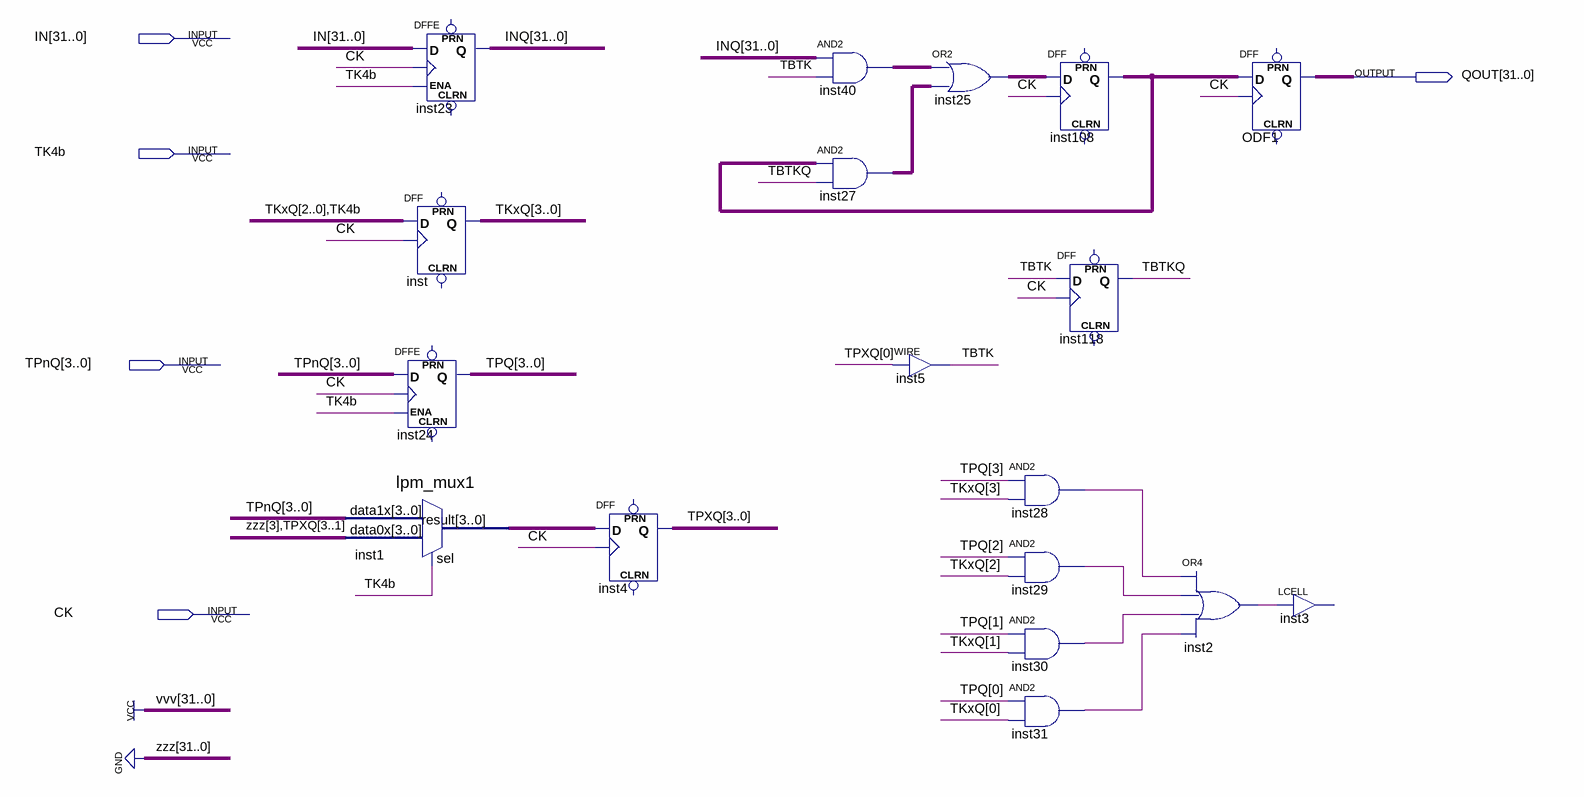
[diagram p0: schematic sheet]
// Quartus schematic Out32ch.bdf as structural Verilog: 18 symbols, 5 pins
module Out32ch (
  input  [31:0] IN,
  input  TK4b,
  input  [3:0] TPnQ,
  input  CK,
  output [31:0] QOUT
);

  wire inst2_out, inst28_out, inst29_out, inst30_out, inst31_out, TBTK, TBTKQ;
  wire [3:0] inst1_result, TKxQ, TPQ, TPXQ;
  wire [31:0] INQ, inst25_out, inst27_out, inst40_out, inst108_q;

  DFFE inst24[3:0] (.D(TPnQ), .CLK(CK), .ENA(TK4b), .Q(TPQ));  // open: PRN, CLRN
  lpm_mux1 inst1 (.data1x(TPnQ), .data0x({1'b0, TPXQ[3:1]}), .sel(TK4b), .result(inst1_result));
  DFFE inst23[31:0] (.D(IN), .CLK(CK), .ENA(TK4b), .Q(INQ));  // open: PRN, CLRN
  DFF inst[3:0] (.CLK(CK), .D({TKxQ[2:0], TK4b}), .Q(TKxQ));  // open: CLRN, PRN
  DFF inst4[3:0] (.CLK(CK), .D(inst1_result), .Q(TPXQ));  // open: CLRN, PRN
  assign inst40_out = INQ & {32{TBTK}};  // AND2 inst40, 32 bits wide
  assign inst27_out = inst108_q & {32{TBTKQ}};  // AND2 inst27, 32 bits wide
  assign inst25_out = inst40_out | inst27_out;  // OR2 inst25, 32 bits wide
  assign TBTK = TPXQ[0];  // WIRE inst5
  and inst28 (inst28_out, TPQ[3], TKxQ[3]);
  and inst29 (inst29_out, TPQ[2], TKxQ[2]);
  and inst30 (inst30_out, TPQ[1], TKxQ[1]);
  and inst31 (inst31_out, TPQ[0], TKxQ[0]);
  DFF inst108[31:0] (.CLK(CK), .D(inst25_out), .Q(inst108_q));  // open: CLRN, PRN
  DFF inst118 (.CLK(CK), .D(TBTK), .Q(TBTKQ));  // open: CLRN, PRN
  DFF ODF1[31:0] (.CLK(CK), .D(inst108_q), .Q(QOUT));  // open: CLRN, PRN
  or inst2 (inst2_out, inst28_out, inst29_out, inst30_out, inst31_out);
  LCELL inst3 (.IN(inst2_out));  // open: OUT
endmodule
